# EAGLE design ATTiny13_ISPProgrammer (EAGLE 6.4)
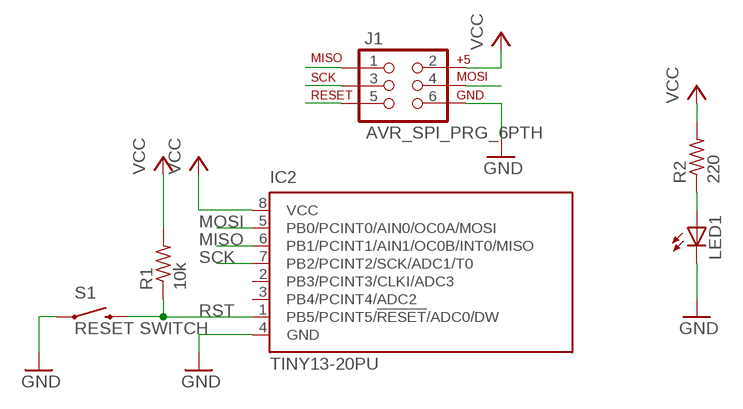
[diagram p0: schematic, sheet 1]

## Parts
IC2  TINY13-20PU  [DIL08]
J1  AVR_SPI_PRG_6PTH  [2X3]
LED1  LED-3MM-NO_SILK  [LED3MM-NS]
R1  10k  R-US_0207/10  [0207/10]
R2  220  R-US_0207/10  [0207/10]
S1  RESET SWITCH  SWITCH-MOMENTARY-2PTH  [TACTILE-PTH]

## Nets
GND: IC2.4(GND) J1.6 LED1.K(C) S1.1
MISO: IC2.6(PB1/PCINT1/AIN1/OC0B/INT0/MISO) J1.1
MOSI: IC2.5(PB0/PCINT0/AIN0/OC0A/MOSI) J1.4
N$1: LED1.A R2.1
RST: IC2.1(PB5/PCINT5/!RESET!/ADC0/DW) J1.5 R1.1 S1.3
SCK: IC2.7(PB2/PCINT2/SCK/ADC1/T0) J1.3
VCC: IC2.8(VCC) J1.2 R1.2 R2.2
Unconnected: IC2.2(PB3/PCINT3/CLKI/ADC3) IC2.3(PB4/PCINT4/ADC2)

## Library data of the parts
IC2 = atmel:TINY13: 8-bit AVR Microcontroller with 1K Bytes In-System Programmable Flash Source: http://www.atmel.com/dyn/resources/prod_documents/2535S.pdf; MPN: ATTINY13-20PU; OC_FARNELL: 9171550; OC_NEWARK: 96K6521
J1 = SparkFun-Connectors:AVR_SPI_PRG_6: AVR ISP 6 Pin This is the reduced ISP connector for AVR programming. Common on Arduino. This footprint will take up less PCB space and can be used with a 10-pin to 6-pin adapter such as SKU: BOB-08508
LED1 = SparkFun-LED:LED: LEDs Standard schematic elements and footprints for 5mm, 3mm, 1206, and 0603 sized LEDs. 5mm - Spark Fun Electronics SKU : COM-00529 (and others)
R1 R2 = rcl:R-US_: RESISTOR, American symbol
S1 = SparkFun-Electromechanical:SWITCH-MOMENTARY-2: Various NO switches- pushbuttons, reed, etc

## Board
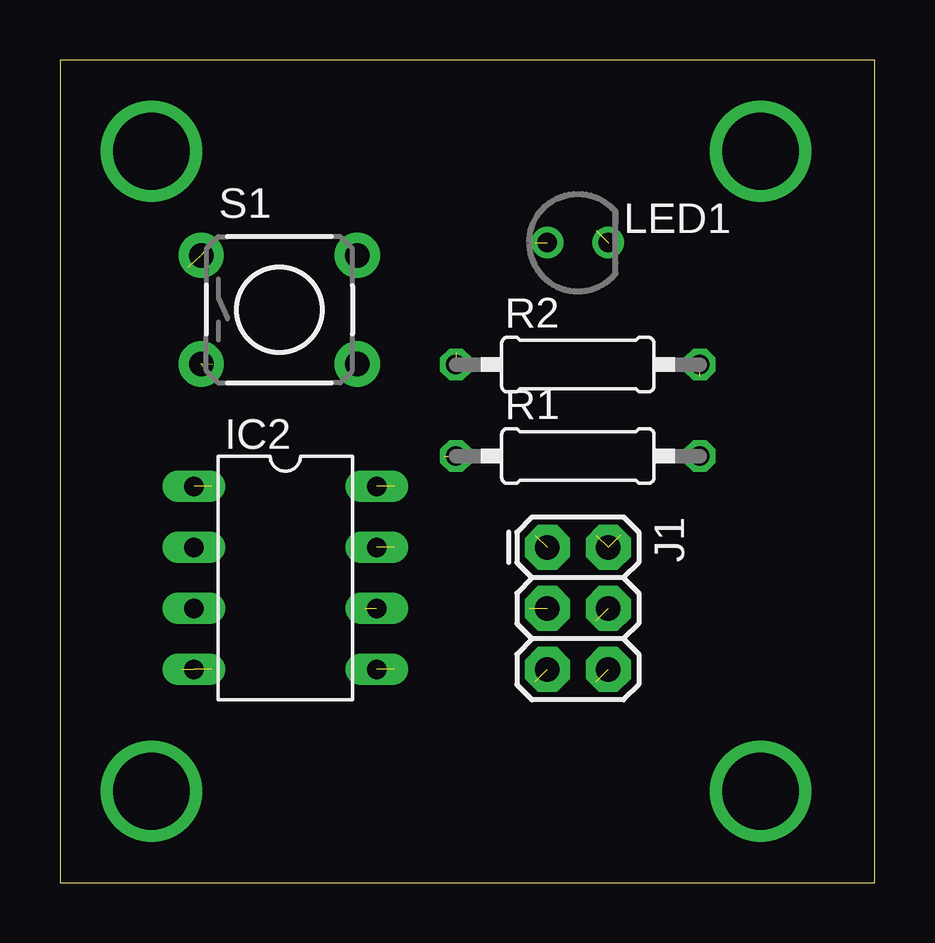
[diagram p1: board, top side]
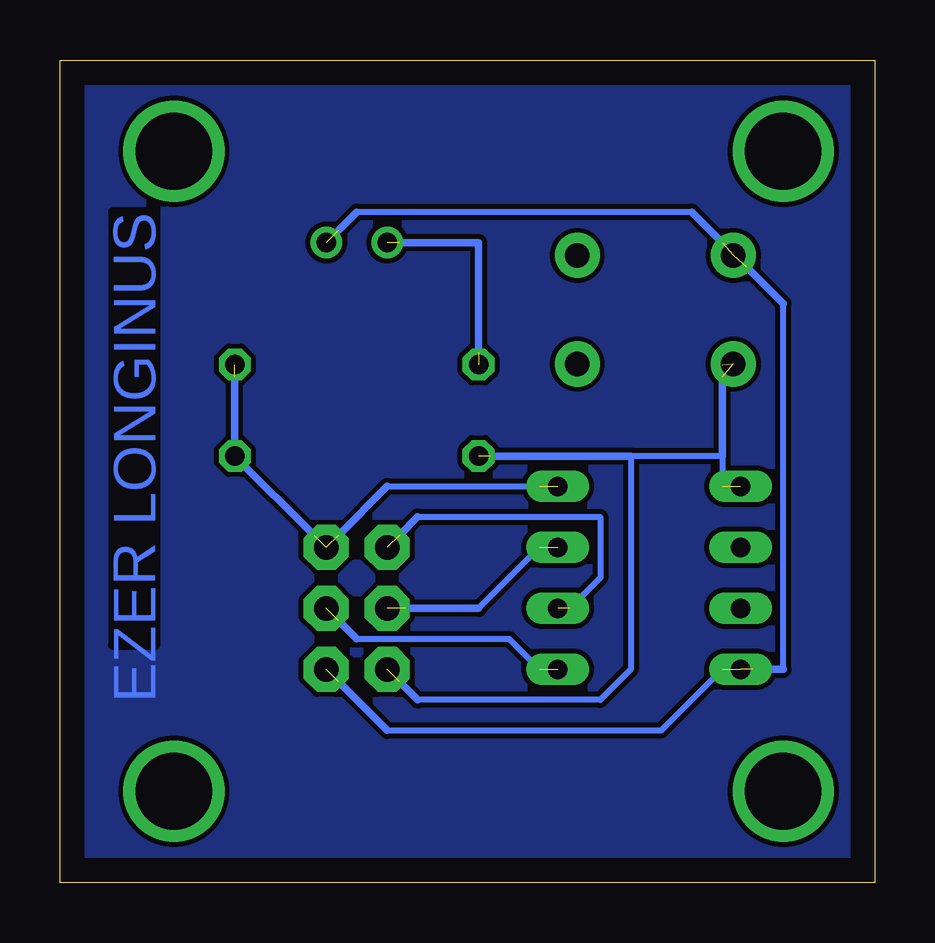
[diagram p2: board, bottom side, seen from below]

Size 33.96 x 34.28 mm. Coordinates in mm from the lower left corner, seen from the top.
Outline: 0,0 33.96,0 33.96,34.28 0,34.28 0,0
Copper layers (1*16): Top 0.035mm / dielectric 1.5mm / Bottom 0.035mm
Design rules "default": minimum track width 10mil, minimum drill 24mil, track to track 8mil, track to pad 8mil, pad to pad 8mil, via to via 8mil, smd to smd 8mil, copper to edge 40mil, drill to drill 8mil, minimum pad ring 10mil, minimum via ring 8mil, stop-mask expansion 4mil, vias tented up to drill 0mil, thermal gap 10mil

### Footprints (pad centres in the part's own frame; a part is rotated, then mirrored left to right if it is on the bottom)
DIL08 = drill 0.813 long: 1 -3.81,-3.81; 2 -1.27,-3.81; 3 1.27,-3.81; 4 3.81,-3.81; 5 3.81,3.81; 6 1.27,3.81; 7 -1.27,3.81; 8 -3.81,3.81
2X3 = drill 1.016 pad 1.88 octagon: 1 0,0; 2 0,2.54; 3 2.54,0; 4 2.54,2.54; 5 5.08,0; 6 5.08,2.54
LED3MM-NS = drill 0.813: A -1.27,0; K 1.27,0
0207/10 = drill 0.813 octagon: 1 -5.08,0; 2 5.08,0
TACTILE-PTH = drill 1.016 pad 1.88: 1 -3.251,2.261; 2 3.251,2.261; 3 -3.251,-2.261; 4 3.251,-2.261

### Placement (x,y rotation side)
IC2  9.4,12.7 270 top
J1  20.32,13.97 270 top
LED1  21.59,26.67 0 top
R1  21.59,17.78 0 top
R2  21.59,21.59 0 top
S1  9.14,23.88 0 top

### Tracks (layer width: path | path; a pad name or v marks a point on that pad's centre or on a via)
GND  (7 unrouted)
  Bottom 0.254: 7.62,27.94 21.59,27.94 | 6.35,8.89 8.89,6.35 20.32,6.35 | 3.81,8.89 3.81,24.13
  Bottom 0.305: 3.81,8.89 5.08,8.89 | 21.59,27.94 22.35,27.18 | 7.62,27.94 6.35,26.67 | 3.81,24.13 5.33,25.65 | 20.32,6.35 22.35,8.38
MISO  (2 unrouted)
  Bottom 0.254: 12.7,11.43 11.43,12.7 11.43,15.24 19.05,15.24
  Bottom 0.305: 19.05,15.24 19.81,14.48
MOSI  (2 unrouted)
  Bottom 0.254: 13.97,8.89 15.24,10.16 21.59,10.16
  Bottom 0.305: 21.59,10.16 22.35,10.92
N$1  (2 unrouted)
  Bottom 0.305: 19.81,26.67 16.51,26.67 16.51,22.1
N$2
  pour Bottom: 0,34.29 34.29,34.29 34.29,0 0,0
N$3  (via drill 3.2)
  other vias: 3.81,3.81
N$4  (via drill 3.2)
  other vias: 3.81,30.48
N$5  (via drill 3.2)
  other vias: 29.21,30.48
N$6  (via drill 3.2)
  other vias: 29.21,3.81
RST  (5 unrouted)
  Bottom 0.254: 6.35,16.51 6.35,17.78 10.16,17.78 10.16,8.89 11.43,7.62 19.05,7.62
  Bottom 0.305: 6.35,17.78 6.35,21.08 | 10.16,17.78 16,17.78 | 19.05,7.62 19.81,8.38
SCK  (2 unrouted)
  Bottom 0.254: 16.51,11.43 13.97,13.97
  Bottom 0.305: 16.51,11.43 19.56,11.43
VCC  (4 unrouted)
  Bottom 0.254: 20.32,16.51 13.97,16.51
  Bottom 0.305: 20.32,16.51 22.35,14.48 | 26.67,21.08 R1.2 23.37,14.48

### Text on the board
Bottom: EZER LONGINUS